# Altium schematic sheet MCU_IO.SchDoc: MCU IOs
size A3; Date: Not used; ApprovedBy: Not used; CheckedBy: Not used; Author: Not used; CompanyName: STMicroelectronics; DrawnBy: Not used; Engineer: Not used; Organization: Not used; Address1: Not used; Address2: Not used; Address3: Not used; Address4: Not used; DocumentNumber: Not used; Revision: Not used; SheetNumber: 3; SheetTotal: 16; CurrentTime: Not used; CurrentDate: Not used; Time: Not used; DocumentFullPathAndName: Not used; DocumentName: Not used; ModifiedDate: Not used; ImagePath: Not used; ProjectName: Not used; Application_BuildNumber: Not used
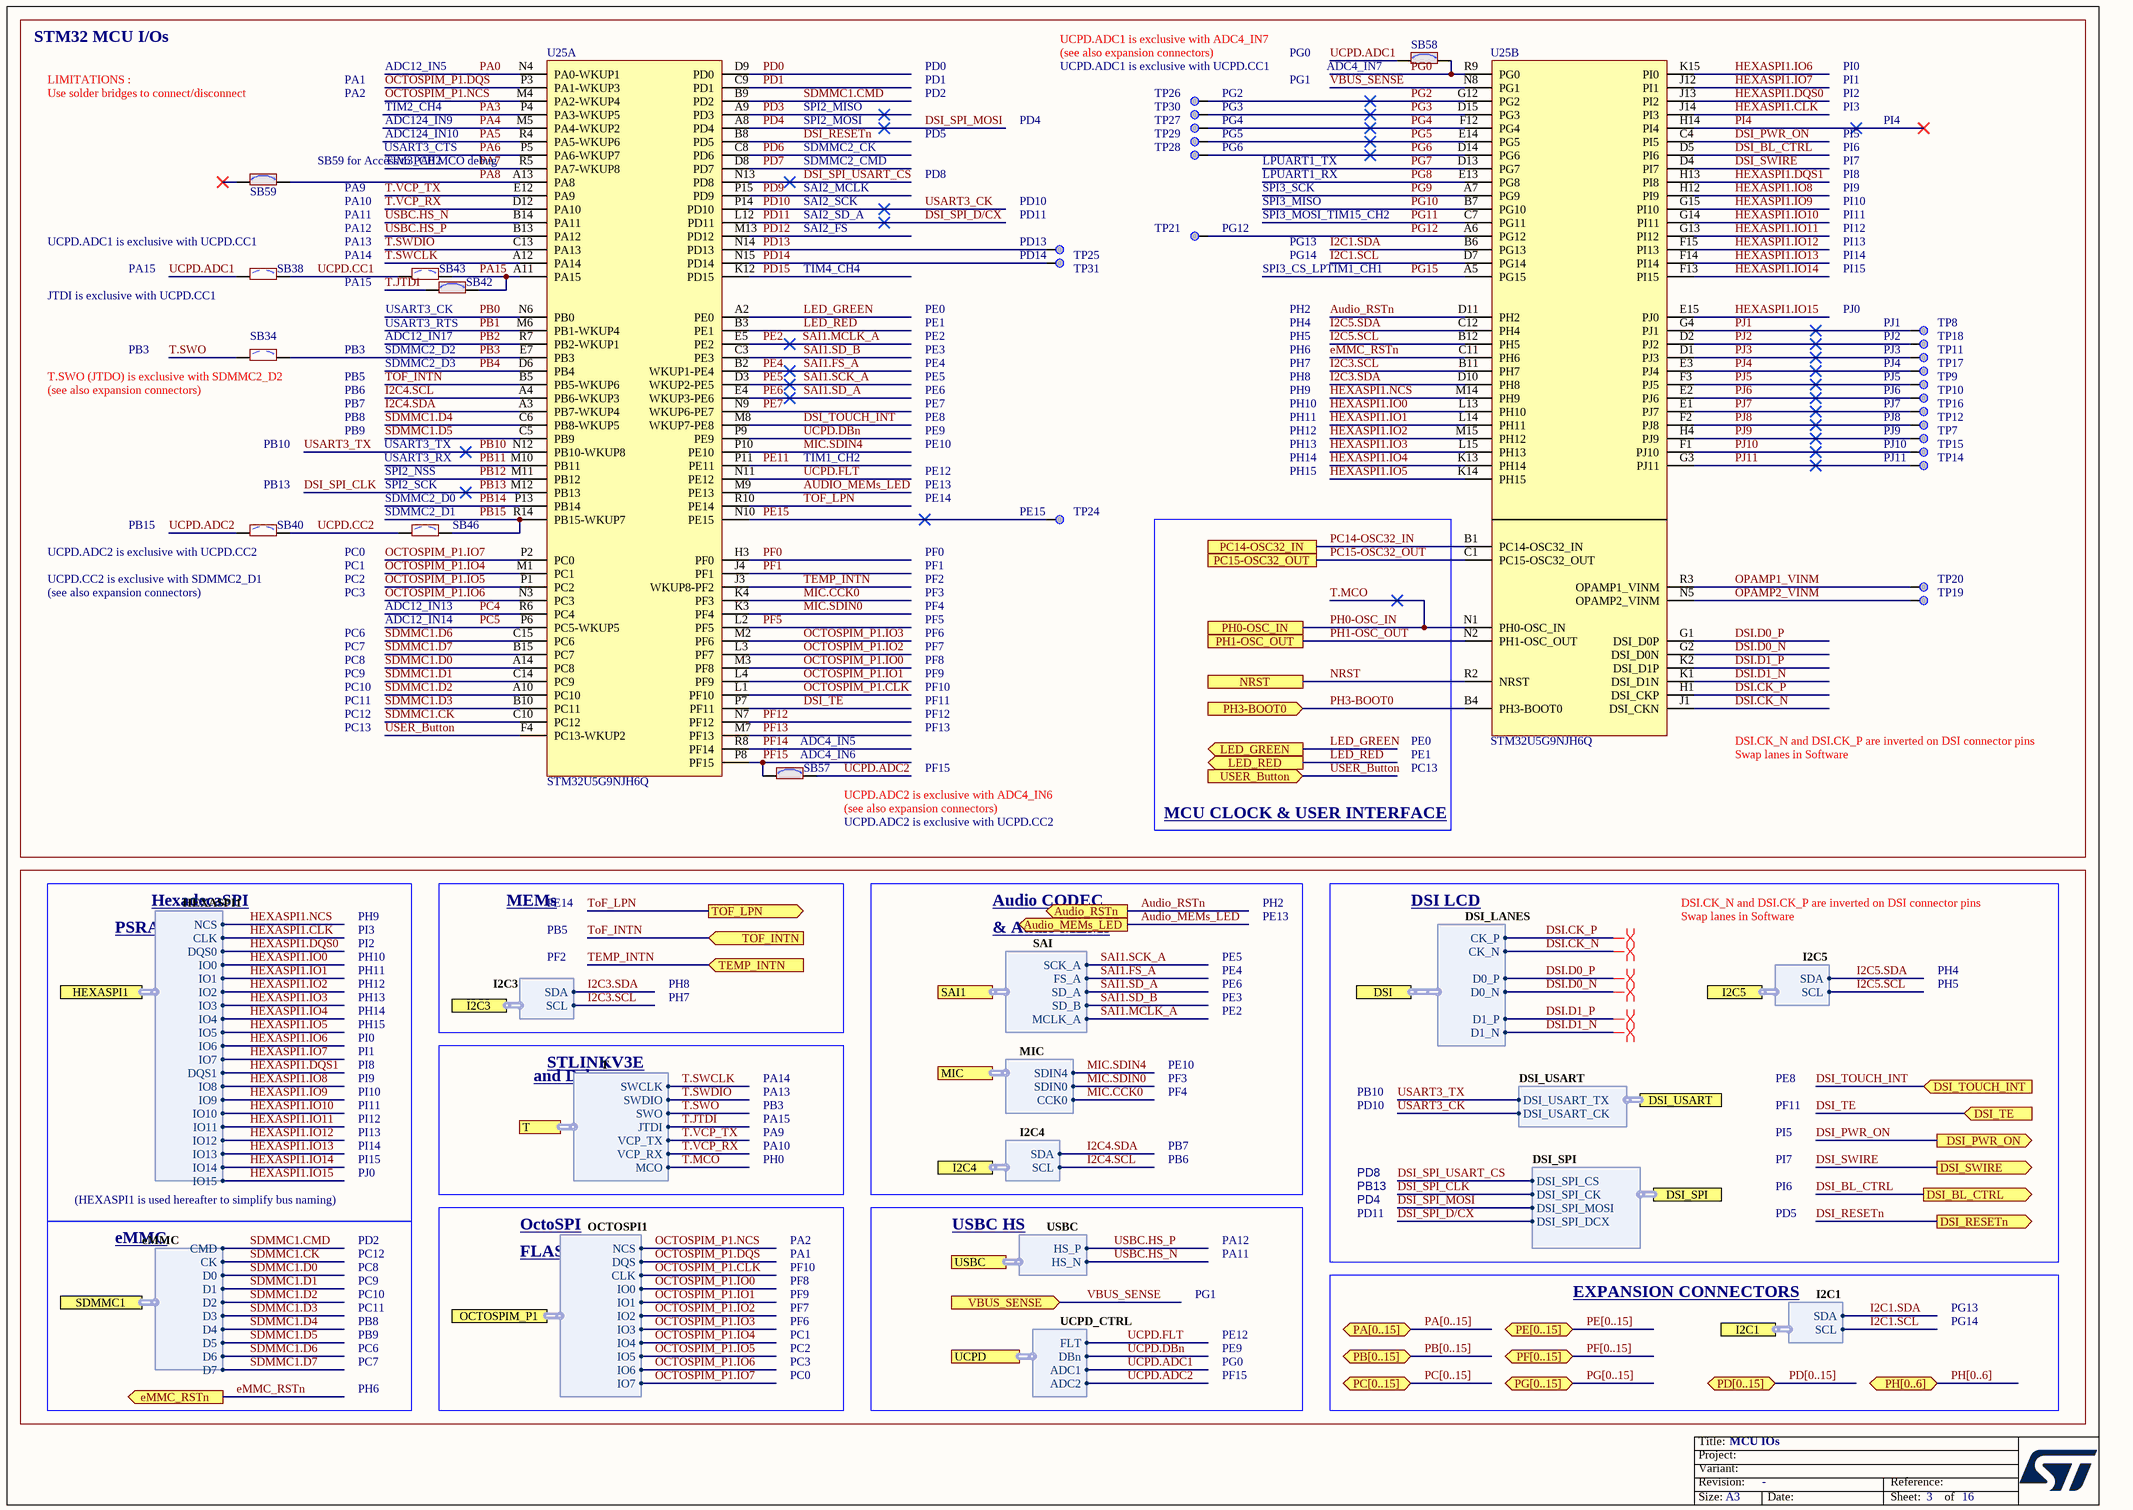
[diagram p0: MCU_IO.SchDoc]

## Parts
SB34  SB_OFF  [SOLDER-BRIDGE_R0402-0R]  (value not drawn)
SB38  SB_OFF  [SOLDER-BRIDGE_R0402-0R]  (value not drawn)
SB40  SB_OFF  [SOLDER-BRIDGE_R0402-0R]  (value not drawn)
SB42  SB_ON  [SOLDER-BRIDGE_R0402-0R]  (value not drawn)
SB43  SB_OFF  [SOLDER-BRIDGE_R0402-0R]  (value not drawn)
SB46  SB_OFF  [SOLDER-BRIDGE_R0402-0R]  (value not drawn)
SB57  SB_ON  [SOLDER-BRIDGE_R0402-0R]  (value not drawn)
SB58  SB_ON  [SOLDER-BRIDGE_R0402-0R]  (value not drawn)
SB59  SB_ON  [SOLDER-BRIDGE_R0402-0R]  (value not drawn)
TP7  Test Point  [TP_SMD_1MM]  (value not drawn)  (no BOM)
TP8  Test Point  [TP_SMD_1MM]  (value not drawn)  (no BOM)
TP9  Test Point  [TP_SMD_1MM]  (value not drawn)  (no BOM)
TP10  Test Point  [TP_SMD_1MM]  (value not drawn)  (no BOM)
TP11  Test Point  [TP_SMD_1MM]  (value not drawn)  (no BOM)
TP12  Test Point  [TP_SMD_1MM]  (value not drawn)  (no BOM)
TP14  Test Point  [TP_SMD_1MM]  (value not drawn)  (no BOM)
TP15  Test Point  [TP_SMD_1MM]  (value not drawn)  (no BOM)
TP16  Test Point  [TP_SMD_1MM]  (value not drawn)  (no BOM)
TP17  Test Point  [TP_SMD_1MM]  (value not drawn)  (no BOM)
TP18  Test Point  [TP_SMD_1MM]  (value not drawn)  (no BOM)
TP19  Test Point  [TP_SMD_1MM]  (value not drawn)  (no BOM)
TP20  Test Point  [TP_SMD_1MM]  (value not drawn)  (no BOM)
TP21  Test Point  [TP_SMD_1MM]  (value not drawn)  (no BOM)
TP24  Test Point  [TP_SMD_1MM]  (value not drawn)  (no BOM)
TP25  Test Point  [TP_SMD_1MM]  (value not drawn)  (no BOM)
TP26  Test Point  [TP_SMD_1MM]  (value not drawn)  (no BOM)
TP27  Test Point  [TP_SMD_1MM]  (value not drawn)  (no BOM)
TP28  Test Point  [TP_SMD_1MM]  (value not drawn)  (no BOM)
TP29  Test Point  [TP_SMD_1MM]  (value not drawn)  (no BOM)
TP30  Test Point  [TP_SMD_1MM]  (value not drawn)  (no BOM)
TP31  Test Point  [TP_SMD_1MM]  (value not drawn)  (no BOM)
U25  value STM32U5G9NJH6Q  [ICC_TFBGA216_13X13_P080_H1P10_CODE-A0L2]  (hidden comment: STM32U599NJH6Q_BGA216_SMPS)  (parts A,B of 3)

## Ports
Audio_MEMs_LED (out), Audio_RSTn (out), DSI (harness DSI_LANES), DSI_BL_CTRL (out), DSI_PWR_ON (out), DSI_RESETn (out), DSI_SPI (harness DSI_SPI), DSI_SWIRE (out), DSI_TE (in), DSI_TOUCH_INT (in), DSI_USART (harness DSI_USART), eMMC_RSTn (out), HEXASPI1 (harness HEXASPI1), I2C1 (harness I2C1), I2C3 (harness I2C3), I2C4 (harness I2C4), I2C5 (harness I2C5), LED_GREEN (out), LED_RED (out), MIC (harness MIC), NRST, OCTOSPIM_P1 (harness OCTOSPI1), PA[0..15] (bidir), PB[0..15] (bidir), PC14-OSC32_IN, PC15-OSC32_OUT, PC[0..15] (bidir), PD[0..15] (bidir), PE[0..15] (bidir), PF[0..15] (bidir), PG[0..15] (bidir), PH0-OSC_IN, PH1-OSC_OUT, PH3-BOOT0 (in), PH[0..6] (bidir), SAI1 (harness SAI), SDMMC1 (harness eMMC), T (harness T), TEMP_INTN (in), TOF_INTN (in), TOF_LPN (out), UCPD (harness UCPD_CTRL), USBC (harness USBC), USER_Button (in), VBUS_SENSE (in)

## Harnesses
T: SWCLK, SWDIO, SWO, JTDI, VCP_RX, VCP_TX, MCO
MIC: SDIN0, CCK0, SDIN4
OCTOSPI1: IO1, IO0, CLK, NCS, IO2, IO3, IO5, IO4, IO6, IO7, DQS
eMMC: D0, CMD, CK, D1, D2, D3, D4, D5, D6, D7
SAI: SD_B, FS_A, SD_A, SCK_A, MCLK_A
DSI_LANES: CK_P, CK_N, D0_P, D0_N, D1_N, D1_P
USBC: HS_P, HS_N
DSI_SPI: DSI_SPI_CS, DSI_SPI_MOSI, DSI_SPI_CK, DSI_SPI_DCX
DSI_USART: DSI_USART_CK, DSI_USART_TX
I2C4: SDA, SCL
I2C5: SDA, SCL
HEXASPI1: IO1, IO0, DQS0, NCS, IO2, IO3, IO5, IO4, IO6, IO7, CLK, DQS1, IO8, IO9, IO10, IO11, IO12, IO13, IO14, IO15
UCPD_CTRL: FLT, DBn, ADC1, ADC2
I2C1: SDA, SCL
I2C3: SDA, SCL

## Nets
AUDIO_MEMs_LED: U25.M9(PE13) ; port Audio_MEMs_LED
Audio_RSTn: U25.D11(PH2) ; port Audio_RSTn
DSI.CK_N: U25.J1(DSI_CKN) ; port DSI.CK_N
DSI.CK_P: U25.H1(DSI_CKP) ; port DSI.CK_P
DSI.D0_N: U25.G2(DSI_D0N) ; port DSI.D0_N
DSI.D0_P: U25.G1(DSI_D0P) ; port DSI.D0_P
DSI.D1_N: U25.K1(DSI_D1N) ; port DSI.D1_N
DSI.D1_P: U25.K2(DSI_D1P) ; port DSI.D1_P
DSI_BL_CTRL: U25.D5(PI6) ; port DSI_BL_CTRL
DSI_PWR_ON: U25.C4(PI5) ; port DSI_PWR_ON
DSI_RESETn: U25.B8(PD5) ; port DSI_RESETn
DSI_SPI_CLK: U25.M12(PB13) ; port DSI_SPI.DSI_SPI_CK  [also labelled PB13]
DSI_SPI_D/CX: U25.L12(PD11) ; port DSI_SPI.DSI_SPI_DCX  [also labelled PD11]
DSI_SPI_MOSI: U25.A8(PD4) ; port DSI_SPI.DSI_SPI_MOSI  [also labelled PD4]
DSI_SPI_USART_CS: U25.N13(PD8) ; port DSI_SPI.DSI_SPI_CS
DSI_SWIRE: U25.D4(PI7) ; port DSI_SWIRE
DSI_TE: U25.P7(PF11) ; port DSI_TE
DSI_TOUCH_INT: U25.M8(WKUP7-PE8) ; port DSI_TOUCH_INT
eMMC_RSTn: U25.C11(PH6) ; port eMMC_RSTn
HEXASPI1.CLK: U25.J14(PI3) ; port HEXASPI1.CLK
HEXASPI1.DQS0: U25.J13(PI2) ; port HEXASPI1.DQS0
HEXASPI1.DQS1: U25.H13(PI8) ; port HEXASPI1.DQS1
HEXASPI1.IO0: U25.L13(PH10) ; port HEXASPI1.IO0
HEXASPI1.IO1: U25.L14(PH11) ; port HEXASPI1.IO1
HEXASPI1.IO2: U25.M15(PH12) ; port HEXASPI1.IO2
HEXASPI1.IO3: U25.L15(PH13) ; port HEXASPI1.IO3
HEXASPI1.IO4: U25.K13(PH14) ; port HEXASPI1.IO4
HEXASPI1.IO5: U25.K14(PH15) ; port HEXASPI1.IO5
HEXASPI1.IO6: U25.K15(PI0) ; port HEXASPI1.IO6
HEXASPI1.IO7: U25.J12(PI1) ; port HEXASPI1.IO7
HEXASPI1.IO8: U25.H12(PI9) ; port HEXASPI1.IO8
HEXASPI1.IO9: U25.G15(PI10) ; port HEXASPI1.IO9
HEXASPI1.IO10: U25.G14(PI11) ; port HEXASPI1.IO10
HEXASPI1.IO11: U25.G13(PI12) ; port HEXASPI1.IO11
HEXASPI1.IO12: U25.F15(PI13) ; port HEXASPI1.IO12
HEXASPI1.IO13: U25.F14(PI14) ; port HEXASPI1.IO13
HEXASPI1.IO14: U25.F13(PI15) ; port HEXASPI1.IO14
HEXASPI1.IO15: U25.E15(PJ0) ; port HEXASPI1.IO15
HEXASPI1.NCS: U25.M14(PH9) ; port HEXASPI1.NCS
I2C1.SCL: U25.D7(PG14) ; port I2C1.SCL
I2C1.SDA: U25.B6(PG13) ; port I2C1.SDA
I2C3.SCL: U25.B11(PH7) ; port I2C3.SCL
I2C3.SDA: U25.D10(PH8) ; port I2C3.SDA
I2C4.SCL: U25.A4(PB6-WKUP3) ; port I2C4.SCL
I2C4.SDA: U25.A3(PB7-WKUP4) ; port I2C4.SDA
I2C5.SCL: U25.B12(PH5) ; port I2C5.SCL
I2C5.SDA: U25.C12(PH4) ; port I2C5.SDA
LED_GREEN: U25.A2(PE0) ; port LED_GREEN
LED_RED: U25.B3(PE1) ; port LED_RED
MIC.CCK0: U25.K4(PF3) ; port MIC.CCK0
MIC.SDIN0: U25.K3(PF4) ; port MIC.SDIN0
MIC.SDIN4: U25.P10(PE10) ; port MIC.SDIN4
NRST: U25.R2(NRST) ; port NRST
OCTOSPIM_P1.CLK: U25.L1(PF10) ; port OCTOSPIM_P1.CLK
OCTOSPIM_P1.DQS: U25.P3(PA1-WKUP3) ; port OCTOSPIM_P1.DQS
OCTOSPIM_P1.IO0: U25.M3(PF8) ; port OCTOSPIM_P1.IO0
OCTOSPIM_P1.IO1: U25.L4(PF9) ; port OCTOSPIM_P1.IO1
OCTOSPIM_P1.IO2: U25.L3(PF7) ; port OCTOSPIM_P1.IO2
OCTOSPIM_P1.IO3: U25.M2(PF6) ; port OCTOSPIM_P1.IO3
OCTOSPIM_P1.IO4: U25.M1(PC1) ; port OCTOSPIM_P1.IO4
OCTOSPIM_P1.IO5: U25.P1(PC2) ; port OCTOSPIM_P1.IO5
OCTOSPIM_P1.IO6: U25.N3(PC3) ; port OCTOSPIM_P1.IO6
OCTOSPIM_P1.IO7: U25.P2(PC0) ; port OCTOSPIM_P1.IO7
OCTOSPIM_P1.NCS: U25.M4(PA2-WKUP4) ; port OCTOSPIM_P1.NCS
OPAMP1_VINM: TP20.1 U25.R3(OPAMP1_VINM)
OPAMP2_VINM: TP19.1 U25.N5(OPAMP2_VINM)
PA0: U25.N4(PA0-WKUP1)
PA3: U25.P4(PA3-WKUP5)
PA4: U25.M5(PA4-WKUP2)
PA5: U25.R4(PA5-WKUP6)
PA6: U25.P5(PA6-WKUP7)
PA7: U25.R5(PA7-WKUP8)
PA8: SB59.2 U25.A13(PA8)
PA15: SB42.2 SB43.2 U25.A11(PA15)
PB0: U25.N6(PB0)
PB1: U25.M6(PB1-WKUP4)
PB2: U25.R7(PB2-WKUP1)
PB3: SB34.2 U25.E7(PB3)
PB4: U25.D6(PB4)
PB10: U25.N12(PB10-WKUP8) ; port DSI_USART.DSI_USART_TX  [also labelled USART3_TX]
PB11: U25.M10(PB11)
PB12: U25.M11(PB12)
PB14: U25.P13(PB14)
PB15: SB46.2 U25.R14(PB15-WKUP7)
PC4: U25.R6(PC4)
PC5: U25.P6(PC5-WKUP5)
PC14-OSC32_IN: U25.B1(PC14-OSC32_IN) ; port PC14-OSC32_IN
PC15-OSC32_OUT: U25.C1(PC15-OSC32_OUT) ; port PC15-OSC32_OUT
PD0: U25.D9(PD0)
PD1: U25.C9(PD1)
PD3: U25.A9(PD3)
PD6: U25.C8(PD6)
PD7: U25.D8(PD7)
PD9: U25.P15(PD9)
PD10: U25.P14(PD10) ; port DSI_USART.DSI_USART_CK  [also labelled USART3_CK]
PD12: U25.M13(PD12)
PD13: TP25.1 U25.N14(PD13)
PD14: TP31.1 U25.N15(PD14)
PD15: U25.K12(PD15)
PE2: U25.E5(PE2) ; port SAI1.MCLK_A  [also labelled SAI1.MCLK_A]
PE4: U25.B2(WKUP1-PE4) ; port SAI1.FS_A  [also labelled SAI1.FS_A]
PE5: U25.D3(WKUP2-PE5) ; port SAI1.SCK_A  [also labelled SAI1.SCK_A]
PE6: U25.E4(WKUP3-PE6) ; port SAI1.SD_A  [also labelled SAI1.SD_A]
PE7: U25.N9(WKUP6-PE7)
PE11: U25.P11(PE11)
PE15: TP24.1 U25.N10(PE15)
PF0: U25.H3(PF0)
PF1: U25.J4(PF1)
PF5: U25.L2(PF5)
PF12: U25.N7(PF12)
PF13: U25.M7(PF13)
PF14: U25.R8(PF14)
PF15: SB57.1 U25.P8(PF15)
PG0: SB58.2 U25.R9(PG0)
PG2: TP26.1 U25.G12(PG2)
PG3: TP30.1 U25.D15(PG3)
PG4: TP27.1 U25.F12(PG4)
PG5: TP29.1 U25.E14(PG5)
PG6: TP28.1 U25.D14(PG6)
PG7: U25.D13(PG7)
PG8: U25.E13(PG8)
PG9: U25.A7(PG9)
PG10: U25.B7(PG10)
PG11: U25.C7(PG11)
PG12: TP21.1 U25.A6(PG12)
PG15: U25.A5(PG15)
PH0-OSC_IN: U25.N1(PH0-OSC_IN) ; port PH0-OSC_IN, port T.MCO  [also labelled T.MCO]
PH1-OSC_OUT: U25.N2(PH1-OSC_OUT) ; port PH1-OSC_OUT
PH3-BOOT0: U25.B4(PH3-BOOT0) ; port PH3-BOOT0
PI4: U25.H14(PI4)
PJ1: TP8.1 U25.G4(PJ1)
PJ2: TP18.1 U25.D2(PJ2)
PJ3: TP11.1 U25.D1(PJ3)
PJ4: TP17.1 U25.E3(PJ4)
PJ5: TP9.1 U25.F3(PJ5)
PJ6: TP10.1 U25.E2(PJ6)
PJ7: TP16.1 U25.E1(PJ7)
PJ8: TP12.1 U25.F2(PJ8)
PJ9: TP7.1 U25.H4(PJ9)
PJ10: TP15.1 U25.F1(PJ10)
PJ11: TP14.1 U25.G3(PJ11)
SAI1.SD_B: U25.C3(PE3) ; port SAI1.SD_B
SDMMC1.CK: U25.C10(PC12) ; port SDMMC1.CK
SDMMC1.CMD: U25.B9(PD2) ; port SDMMC1.CMD
SDMMC1.D0: U25.A14(PC8) ; port SDMMC1.D0
SDMMC1.D1: U25.C14(PC9) ; port SDMMC1.D1
SDMMC1.D2: U25.A10(PC10) ; port SDMMC1.D2
SDMMC1.D3: U25.B10(PC11) ; port SDMMC1.D3
SDMMC1.D4: U25.C6(PB8-WKUP5) ; port SDMMC1.D4
SDMMC1.D5: U25.C5(PB9) ; port SDMMC1.D5
SDMMC1.D6: U25.C15(PC6) ; port SDMMC1.D6
SDMMC1.D7: U25.B15(PC7) ; port SDMMC1.D7
T.JTDI: SB42.1 ; port T.JTDI
T.SWCLK: U25.A12(PA14) ; port T.SWCLK
T.SWDIO: U25.C13(PA13) ; port T.SWDIO
T.SWO: SB34.1 ; port T.SWO
T.VCP_RX: U25.D12(PA10) ; port T.VCP_RX
T.VCP_TX: U25.E12(PA9) ; port T.VCP_TX
TEMP_INTN: U25.J3(WKUP8-PF2) ; port TEMP_INTN
ToF_INTN: U25.B5(PB5-WKUP6) ; port TOF_INTN
ToF_LPN: U25.R10(PE14) ; port TOF_LPN
UCPD.ADC1: SB38.1 SB58.1 ; port UCPD.ADC1
UCPD.ADC2: SB40.1 SB57.2 ; port UCPD.ADC2
UCPD.CC1: SB38.2 SB43.1
UCPD.CC2: SB40.2 SB46.1
UCPD.DBn: U25.P9(PE9) ; port UCPD.DBn
UCPD.FLT: U25.N11(PE12) ; port UCPD.FLT
USBC.HS_N: U25.B14(PA11) ; port USBC.HS_N
USBC.HS_P: U25.B13(PA12) ; port USBC.HS_P
USER_Button: U25.F4(PC13-WKUP2) ; port USER_Button
VBUS_SENSE: U25.N8(PG1) ; port VBUS_SENSE

Not connected (* = marked no-connect by the designer): SB59 1*

## Buses and harness runs
bus PA[0..15] = port PA[0..15]
bus PB[0..15] = port PB[0..15]
bus PC[0..15] = port PC[0..15]
bus PD[0..15] = port PD[0..15]
bus PE[0..15] = port PE[0..15]
bus PF[0..15] = port PF[0..15]
bus PG[0..15] = port PG[0..15]
bus PH[0..6] = port PH[0..6]

## Layout directives
differential pair; rule Impedance Constraint [Min = 95.00    Max = 105.0    ]: DSI.CK_N, DSI.CK_P, DSI.D0_N, DSI.D0_P, DSI.D1_N, DSI.D1_P

## Notes on the sheet
- STM32 MCU I/Os
- UCPD.ADC1 is exclusive with ADC4_IN7
- Use solder bridges to connect/disconnect
- LIMITATIONS :
- PA1
- PA2
- TIM2_CH4
- ADC12_IN5
- SPI2_MISO
- PD2
- PD1
- PD0
- UCPD.ADC1 is exclusive with UCPD.CC1
- (see also expansion connectors)
- PG2
- PG3
- PG1
- PG0
- (near SB58) ADC4_IN7
- PI0
- PI1
- PI2
- PI3
- (near SB59) SB59 for Access to PA8 MCO debug
- ADC124_IN9
- ADC124_IN10
- TIM3_CH2
- USART3_CTS
- SDMMC2_CK
- SDMMC2_CMD
- SPI2_MOSI
- PD8
- PD5
- PD4
- PG4
- PG5
- PG6
- LPUART1_TX
- LPUART1_RX
- PI8
- PI6
- PI7
- PI5
- PI4
- (near SB38) UCPD.ADC1 is exclusive with UCPD.CC1
- PA13
- PA10
- PA9
- PA12
- PA11
- SAI2_MCLK
- SAI2_SCK
- SAI2_SD_A
- SAI2_FS
- PD10
- PD11
- PD13
- (near TP21) PG12
- SPI3_SCK
- SPI3_MISO
- SPI3_MOSI_TIM15_CH2
- PG13
- PI9
- PI10
- PI11
- PI12
- PI13
- (near SB38) JTDI is exclusive with UCPD.CC1
- PA15
- PA14
- (near SB42) USART3_CK
- TIM4_CH4
- PE0
- PD14
- SPI3_CS_LPTIM1_CH1
- PG14
- PH2
- PI14
- PI15
- PJ0
- (near SB34) T.SWO (JTDO) is exclusive with SDMMC2_D2
- PB3
- PB5
- SDMMC2_D2
- SDMMC2_D3
- ADC12_IN17
- USART3_RTS
- PE1
- PE2
- PE3
- PE4
- PE5
- PH4
- PH5
- PH6
- PH7
- PH8
- PJ1
- PJ2
- PJ3
- PJ4
- PJ5
- (near SB34) (see also expansion connectors)
- PB10
- PB8
- PB9
- PB6
- PB7
- USART3_TX
- PE6
- PE7
- PE8
- PE10
- PE9
- PH9
- PH11
- PH12
- PH13
- PH10
- PJ6
- PJ7
- PJ8
- PJ9
- PJ10
- (near SB40) PB13
- (near SB46) SDMMC2_D0
- (near SB46) SDMMC2_D1
- (near SB46) SPI2_SCK
- SPI2_NSS
- USART3_RX
- TIM1_CH2
- PE13
- PE14
- PE12
- (near TP24) PE15
- PH14
- PH15
- PJ11
- (near SB40) UCPD.CC2 is exclusive with SDMMC2_D1
- (near SB40) UCPD.ADC2 is exclusive with UCPD.CC2
- PB15
- PC0
- PC1
- PC2
- PF1
- PF0
- PF2
- PC6
- PC7
- PC3
- ADC12_IN14
- ADC12_IN13
- PF6
- PF7
- PF4
- PF3
- PF5
- PC9
- PC12
- PC8
- PC10
- PC11
- PF9
- PF8
- PF10
- PF12
- PF11
- PC13
- (near SB57) ADC4_IN5
- (near SB57) ADC4_IN6
- PF13
- PF15
- DSI.CK_N and DSI.CK_P are inverted on DSI connector pins
- Swap lanes in Software
- (near SB57) UCPD.ADC2 is exclusive with ADC4_IN6
- UCPD.ADC2 is exclusive with UCPD.CC2
- (near SB57) (see also expansion connectors)
- MCU CLOCK & USER INTERFACE
- HexadecaSPI
- MEMs
- Audio CODEC
- DSI LCD
- PSRAM
- & Audio MEMs
- and Debug
- STLINKV3E
- PH0
- PB13
- (HEXASPI1 is used hereafter to simplify bus naming)
- eMMC
- OctoSPI
- FLASH
- USBC HS
- EXPANSION CONNECTORS
- Title:
- Project:
- Size:
- Revision:
- Variant:
- A3
- -
- Date:
- Reference:
- Sheet:
- of

## Library data of the parts
SB34 SB38 SB40 SB43 SB46 = MCD-02162: Solder Bridge 0402 OFF; Part_Type: Misc; Manufacturer_Part_Number: RC0402JR-070RL; Manufacturer: YAGEO; Part_Preference: Recommended; Order_Code_RS: 618-5804; Component_Country_Of_Origin: China; Internal_Part_Number: MCD-02162; Status: Checked; Package: SB0402; ComponentLink1URL: http://tunmcdsvn.tun.st.com/Component_Datasheet_Library/Trunk/Resistors/Yageo_Resistor_RC0402-series; Order_Code_Digikey: 311-0.0JRTR-ND; Order_Code_Farnell: 2363467
SB42 SB57-SB59 = MCD-01618: Solder Bridge 0402 ON; Part_Type: Misc; Manufacturer_Part_Number: RC0402JR-070RL; Manufacturer: YAGEO; Part_Preference: Recommended; Order_Code_RS: 618-5804; Component_Country_Of_Origin: China; Internal_Part_Number: MCD-01618; Status: Released; Package: SB0402; ComponentLink1URL: http://tunmcdsvn.tun.st.com/Component_Datasheet_Library/Trunk/Resistors/Yageo_Resistor_RC0402-series; Order_Code_Digikey: 311-0.0JRTR-ND; Order_Code_Farnell: 2363467
TP7-TP12 TP14-TP21 TP24-TP31 = MCD-00074: Test Point 1mm; Part_Type: Misc; Part_Preference: Recommended; Internal_Part_Number: MCD-00074; Status: Released; Manufacturer_Part_Number: N/A; Manufacturer: N/A; ComponentLink1URL: http://na; Order_Code_Digikey: N/A; Order_Code_Farnell: N/A; Order_Code_RS: N/A
U25 = MCD-03271: MCU, ARM Cortex-M33, 4MB Flash, 3MB RAM, With Crypto; Part_Type: IC; Part_Preference: Recommended; Manufacturer: STMICROELECTRONICS; Component_Country_Of_Origin: Unknown; ShowFields: YES; ID: 5387; Internal_Part_Number: MCD-03271; Status: Released; Manufacturer_Part_Number: STM32U5G9NJH6Q; Package: TFBGA216; ComponentLink1URL: http://tunmcdsvn.tun.st.com/Component_Documentation_Library/Trunk/IC/STMICROELECTRONICS_STM32U5G9NJH6Q; Order_Code_Digikey: N/A; Order_Code_Farnell: N/A; Order_Code_RS: N/A